# Altium schematic sheet SDEC944-xD_Borniers.SchDoc: Borniers
size 393 x 270 mm; CompanyName: Seccom; Address1: 521, rue du capt. François Garbit; Address2: 69440 Mornant; Address3: seccom@seccom.fr; Address4: www.seccom.fr; DocumentNumber: 22; SheetNumber: 22; SheetTotal: 22; PageSetup: Record=PageOptions|CenterHorizontal=True|CenterVertical=True|PrintScale=0.74|XCorrection=1.00|YCorrection=1.00|PrintKind=0|BorderSize=5000000|LeftOffset=0|BottomOffset=0|Orientation=2|PaperLength=1000|PaperWidth=1000|Scale=100|PaperSource=7|PrintQuality=-4|MediaType=1|DitherType=10|PaperKind=A4|PrintScaleMode=1
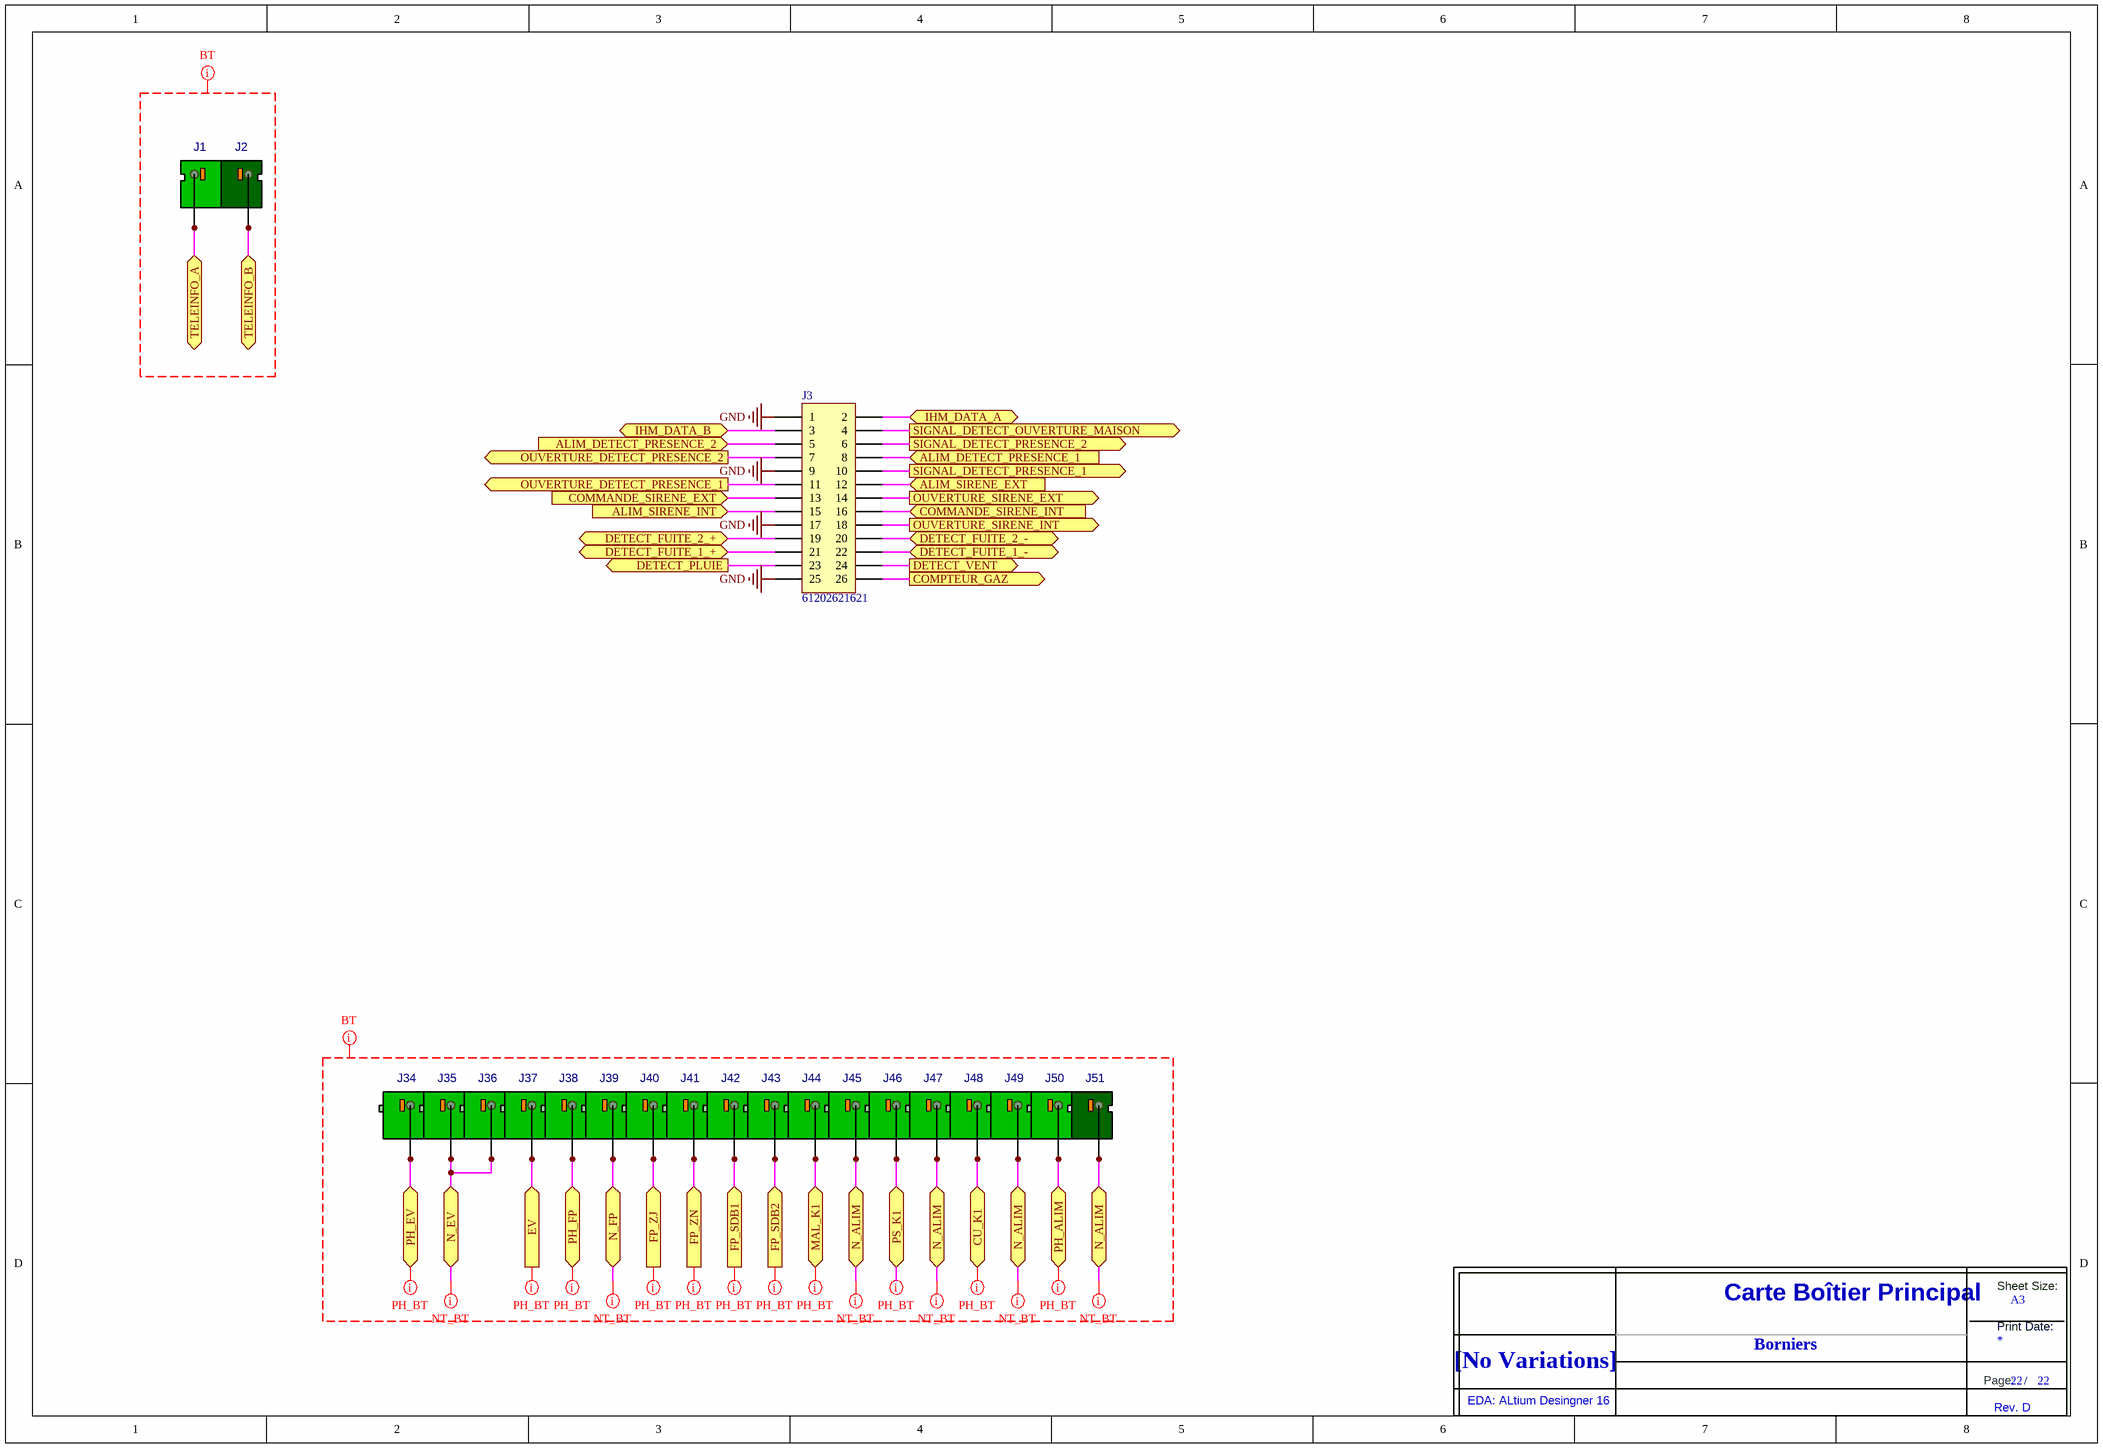
[diagram p0: SDEC944-xD_Borniers.SchDoc]

## Parts
J1  BRESS_CI_D_7.62_01_FFKDSA/V2  [BRESS_FFKDSA/V2-7,62_P1.3]  (value not drawn)
J2  BRESS_CI_D_7.62_01_FFKDSA1/V2  [BRESS_FFKDSA1/V2-7,62_P1.3]  (value not drawn)
J3  61202621621  [IDC2p54_26P]
J34  BRESS_CI_D_7.62_01_FFKDSA/V2  [BRESS_FFKDSA/V2-7,62_P1.3]  (value not drawn)
J35  BRESS_CI_D_7.62_01_FFKDSA/V2  [BRESS_FFKDSA/V2-7,62_P1.3]  (value not drawn)
J36  BRESS_CI_D_7.62_01_FFKDSA/V2  [BRESS_FFKDSA/V2-7,62_P1.3]  (value not drawn)
J37  BRESS_CI_D_7.62_01_FFKDSA/V2  [BRESS_FFKDSA/V2-7,62_P1.3]  (value not drawn)
J38  BRESS_CI_D_7.62_01_FFKDSA/V2  [BRESS_FFKDSA/V2-7,62_P1.3]  (value not drawn)
J39  BRESS_CI_D_7.62_01_FFKDSA/V2  [BRESS_FFKDSA/V2-7,62_P1.3]  (value not drawn)
J40  BRESS_CI_D_7.62_01_FFKDSA/V2  [BRESS_FFKDSA/V2-7,62_P1.3]  (value not drawn)
J41  BRESS_CI_D_7.62_01_FFKDSA/V2  [BRESS_FFKDSA/V2-7,62_P1.3]  (value not drawn)
J42  BRESS_CI_D_7.62_01_FFKDSA/V2  [BRESS_FFKDSA/V2-7,62_P1.3]  (value not drawn)
J43  BRESS_CI_D_7.62_01_FFKDSA/V2  [BRESS_FFKDSA/V2-7,62_P1.3]  (value not drawn)
J44  BRESS_CI_D_7.62_01_FFKDSA/V2  [BRESS_FFKDSA/V2-7,62_P1.3]  (value not drawn)
J45  BRESS_CI_D_7.62_01_FFKDSA/V2  [BRESS_FFKDSA/V2-7,62_P1.3]  (value not drawn)
J46  BRESS_CI_D_7.62_01_FFKDSA/V2  [BRESS_FFKDSA/V2-7,62_P1.3]  (value not drawn)
J47  BRESS_CI_D_7.62_01_FFKDSA/V2  [BRESS_FFKDSA/V2-7,62_P1.3]  (value not drawn)
J48  BRESS_CI_D_7.62_01_FFKDSA/V2  [BRESS_FFKDSA/V2-7,62_P1.3]  (value not drawn)
J49  BRESS_CI_D_7.62_01_FFKDSA/V2  [BRESS_FFKDSA/V2-7,62_P1.3]  (value not drawn)
J50  BRESS_CI_D_7.62_01_FFKDSA/V2  [BRESS_FFKDSA/V2-7,62_P1.3]  (value not drawn)
J51  BRESS_CI_D_7.62_01_FFKDSA1/V2  [BRESS_FFKDSA1/V2-7,62_P1.3]  (value not drawn)
Title_new  DNI  (value not drawn)  (graphical)

## Ports
ALIM_DETECT_PRESENCE_1 (in), ALIM_DETECT_PRESENCE_2 (in), ALIM_SIRENE_EXT (in), ALIM_SIRENE_INT (in), COMMANDE_SIRENE_EXT (in), COMMANDE_SIRENE_INT (in), COMPTEUR_GAZ (out), CU_K1 (bidir), DETECT_FUITE_1_+ (bidir), DETECT_FUITE_1_- (bidir), DETECT_FUITE_2_+ (bidir), DETECT_FUITE_2_- (bidir), DETECT_PLUIE (out), DETECT_VENT (out), EV (in), FP_SDB1 (in), FP_SDB2 (in), FP_ZJ (in), FP_ZN (in), IHM_DATA_A (bidir), IHM_DATA_B (bidir), MAL_K1 (bidir), N_ALIM (bidir), N_EV (bidir), N_FP, OUVERTURE_DETECT_PRESENCE_1 (out), OUVERTURE_DETECT_PRESENCE_2 (out), OUVERTURE_SIRENE_EXT (out), OUVERTURE_SIRENE_INT (out), PH_ALIM (bidir), PH_EV (bidir), PH_FP, PS_K1 (bidir), SIGNAL_DETECT_OUVERTURE_MAISON (out), SIGNAL_DETECT_PRESENCE_1 (out), SIGNAL_DETECT_PRESENCE_2 (out), TELEINFO_A (bidir), TELEINFO_B (bidir)

## Nets
GND: J3.1 J3.9 J3.17 J3.25
ALIM_DETECT_PRESENCE_1: J3.8 ; port ALIM_DETECT_PRESENCE_1
ALIM_DETECT_PRESENCE_2: J3.5 ; port ALIM_DETECT_PRESENCE_2
ALIM_SIRENE_EXT: J3.12 ; port ALIM_SIRENE_EXT
ALIM_SIRENE_INT: J3.15 ; port ALIM_SIRENE_INT
COMMANDE_SIRENE_EXT: J3.13 ; port COMMANDE_SIRENE_EXT
COMMANDE_SIRENE_INT: J3.16 ; port COMMANDE_SIRENE_INT
COMPTEUR_GAZ: J3.26 ; port COMPTEUR_GAZ
CU_K1: J48.1 J48.2 ; port CU_K1
DETECT_FUITE_1_+: J3.21 ; port DETECT_FUITE_1_+
DETECT_FUITE_1_-: J3.22 ; port DETECT_FUITE_1_-
DETECT_FUITE_2_+: J3.19 ; port DETECT_FUITE_2_+
DETECT_FUITE_2_-: J3.20 ; port DETECT_FUITE_2_-
DETECT_PLUIE: J3.23 ; port DETECT_PLUIE
DETECT_VENT: J3.24 ; port DETECT_VENT
EV: J37.1 J37.2 ; port EV
FP_SDB1: J42.1 J42.2 ; port FP_SDB1
FP_SDB2: J43.1 J43.2 ; port FP_SDB2
FP_ZJ: J40.1 J40.2 ; port FP_ZJ
FP_ZN: J41.1 J41.2 ; port FP_ZN
IHM_DATA_A: J3.2 ; port IHM_DATA_A
IHM_DATA_B: J3.3 ; port IHM_DATA_B
MAL_K1: J44.1 J44.2 ; port MAL_K1
N_ALIM: J45.1 J45.2 J47.1 J47.2 J49.1 J49.2 J51.1 J51.2 ; port N_ALIM
N_EV: J35.1 J35.2 J36.1 J36.2 ; port N_EV
N_FP: J39.1 J39.2 ; port N_FP
OUVERTURE_DETECT_PRESENCE_1: J3.11 ; port OUVERTURE_DETECT_PRESENCE_1
OUVERTURE_DETECT_PRESENCE_2: J3.7 ; port OUVERTURE_DETECT_PRESENCE_2
OUVERTURE_SIRENE_EXT: J3.14 ; port OUVERTURE_SIRENE_EXT
OUVERTURE_SIRENE_INT: J3.18 ; port OUVERTURE_SIRENE_INT
PH_ALIM: J50.1 J50.2 ; port PH_ALIM
PH_EV: J34.1 J34.2 ; port PH_EV
PH_FP: J38.1 J38.2 ; port PH_FP
PS_K1: J46.1 J46.2 ; port PS_K1
SIGNAL_DETECT_OUVERTURE_MAISON: J3.4 ; port SIGNAL_DETECT_OUVERTURE_MAISON
SIGNAL_DETECT_PRESENCE_1: J3.10 ; port SIGNAL_DETECT_PRESENCE_1
SIGNAL_DETECT_PRESENCE_2: J3.6 ; port SIGNAL_DETECT_PRESENCE_2
TELEINFO_A: J1.1 J1.2 ; port TELEINFO_A
TELEINFO_B: J2.1 J2.2 ; port TELEINFO_B

## Layout directives
net class BT: (no net found under the mark)
net class PH_BT: CU_K1, EV, FP_SDB1, FP_SDB2, FP_ZJ, FP_ZN, MAL_K1, PH_ALIM, PH_EV, PH_FP, PS_K1
net class NT_BT: N_ALIM, N_EV, N_FP

## Notes on the sheet
- Borniers
- (in symbol Title_new) Sheet Size:; Carte Boîtier Principal; A3; Print Date:; [No Variations]; Page:; /; EDA: ALtium Desingner 16; Rev. D

## Library data of the parts
J1 J34-J50 = BRESS_CI_D_7.62_01_FFKDSA/V2: Bornier à connexion par ressorts/déconnexion par levier, série FFKDSA/V2, e7.62, 1x1pts, droit, juxtaposable, 500V/17.5A, AWG22~16, Vert/Orange; Creation: LJ (21/11/11); Boitier: 7.62x10_h15.8_e7.62_p1.3mm; Remarque: {Remarque}; Fabricant: Phoenix Contact; Ref Fab: 1790377; Coeff: 1; Value: FFKDSA/V2-7,62; Verification: *; ComponentLink1URL: o:\_Documentation\Datasheets\Phoenix\FFKDSA-V2_7,62_1790377.pdf; ComponentLink2URL: o:\_Documentation\Datasheets\_BOITIERS\; Config: *; ComponentLink1Description: Datasheet; ComponentLink2Description: Datasheet
J2 J51 = BRESS_CI_D_7.62_01_FFKDSA1/V2: Bornier à connexion par ressorts/déconnexion par levier, série FFKDSA1/V2, e7.62, 1x1pts, droit, juxtaposable, 500V/17.5A, AWG22~16, Vert/Orange; Creation: LJ (21/11/11); Boitier: 7.62x10_h15.8_e7.62_p1.3mm; Remarque: {Remarque}; Fabricant: Phoenix Contact; Ref Fab: 1790487; Coeff: 1; Value: FFKDSA1/V2-7,62; Verification: *; ComponentLink1URL: o:\_Documentation\Datasheets\Phoenix\FFKDSA1-V2_7,62_1790487.pdf; ComponentLink2URL: o:\_Documentation\Datasheets\_BOITIERS\; Config: *; ComponentLink1Description: Datasheet; ComponentLink2Description: Datasheet
J3 = Header 13X2: 26 Positions Header, Shrouded Connector 0.100" (2.54mm) Through Hole Gold; Manufacturer: Wurth Electronics Inc; Supplier 1: Digi-Key; Supplier Part Number 1: 732-2097-ND; Manufacturer Part Number: 61202621621; Fabricant: Wurth Electronics Inc; Ref Fab: 61202621621; Value: 61202621621
Title_new = Title_new